# EAGLE design MBO (EAGLE 7.4.0)
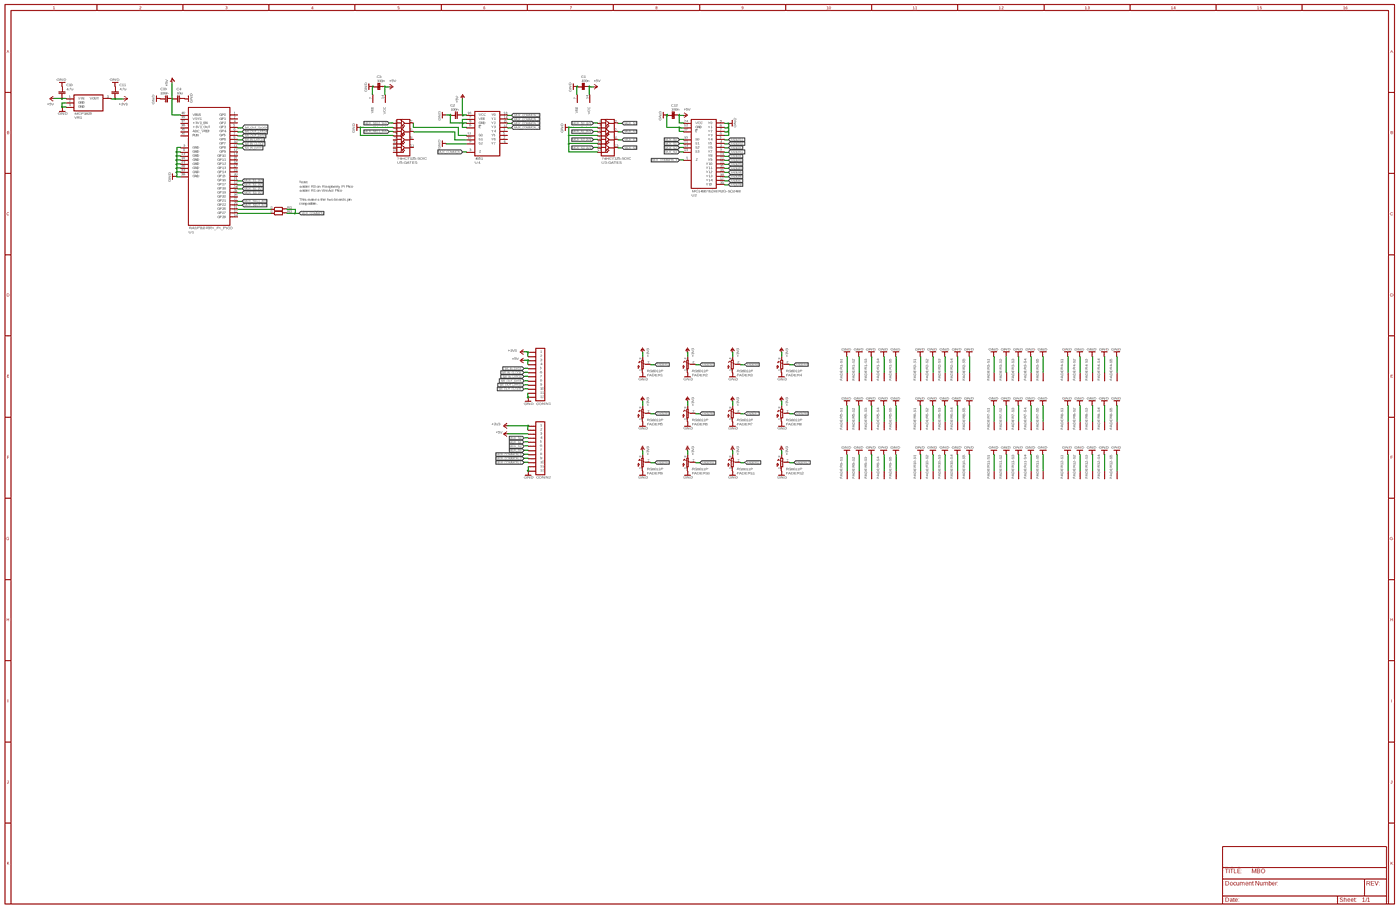
[diagram p0: schematic, sheet 1, overview]
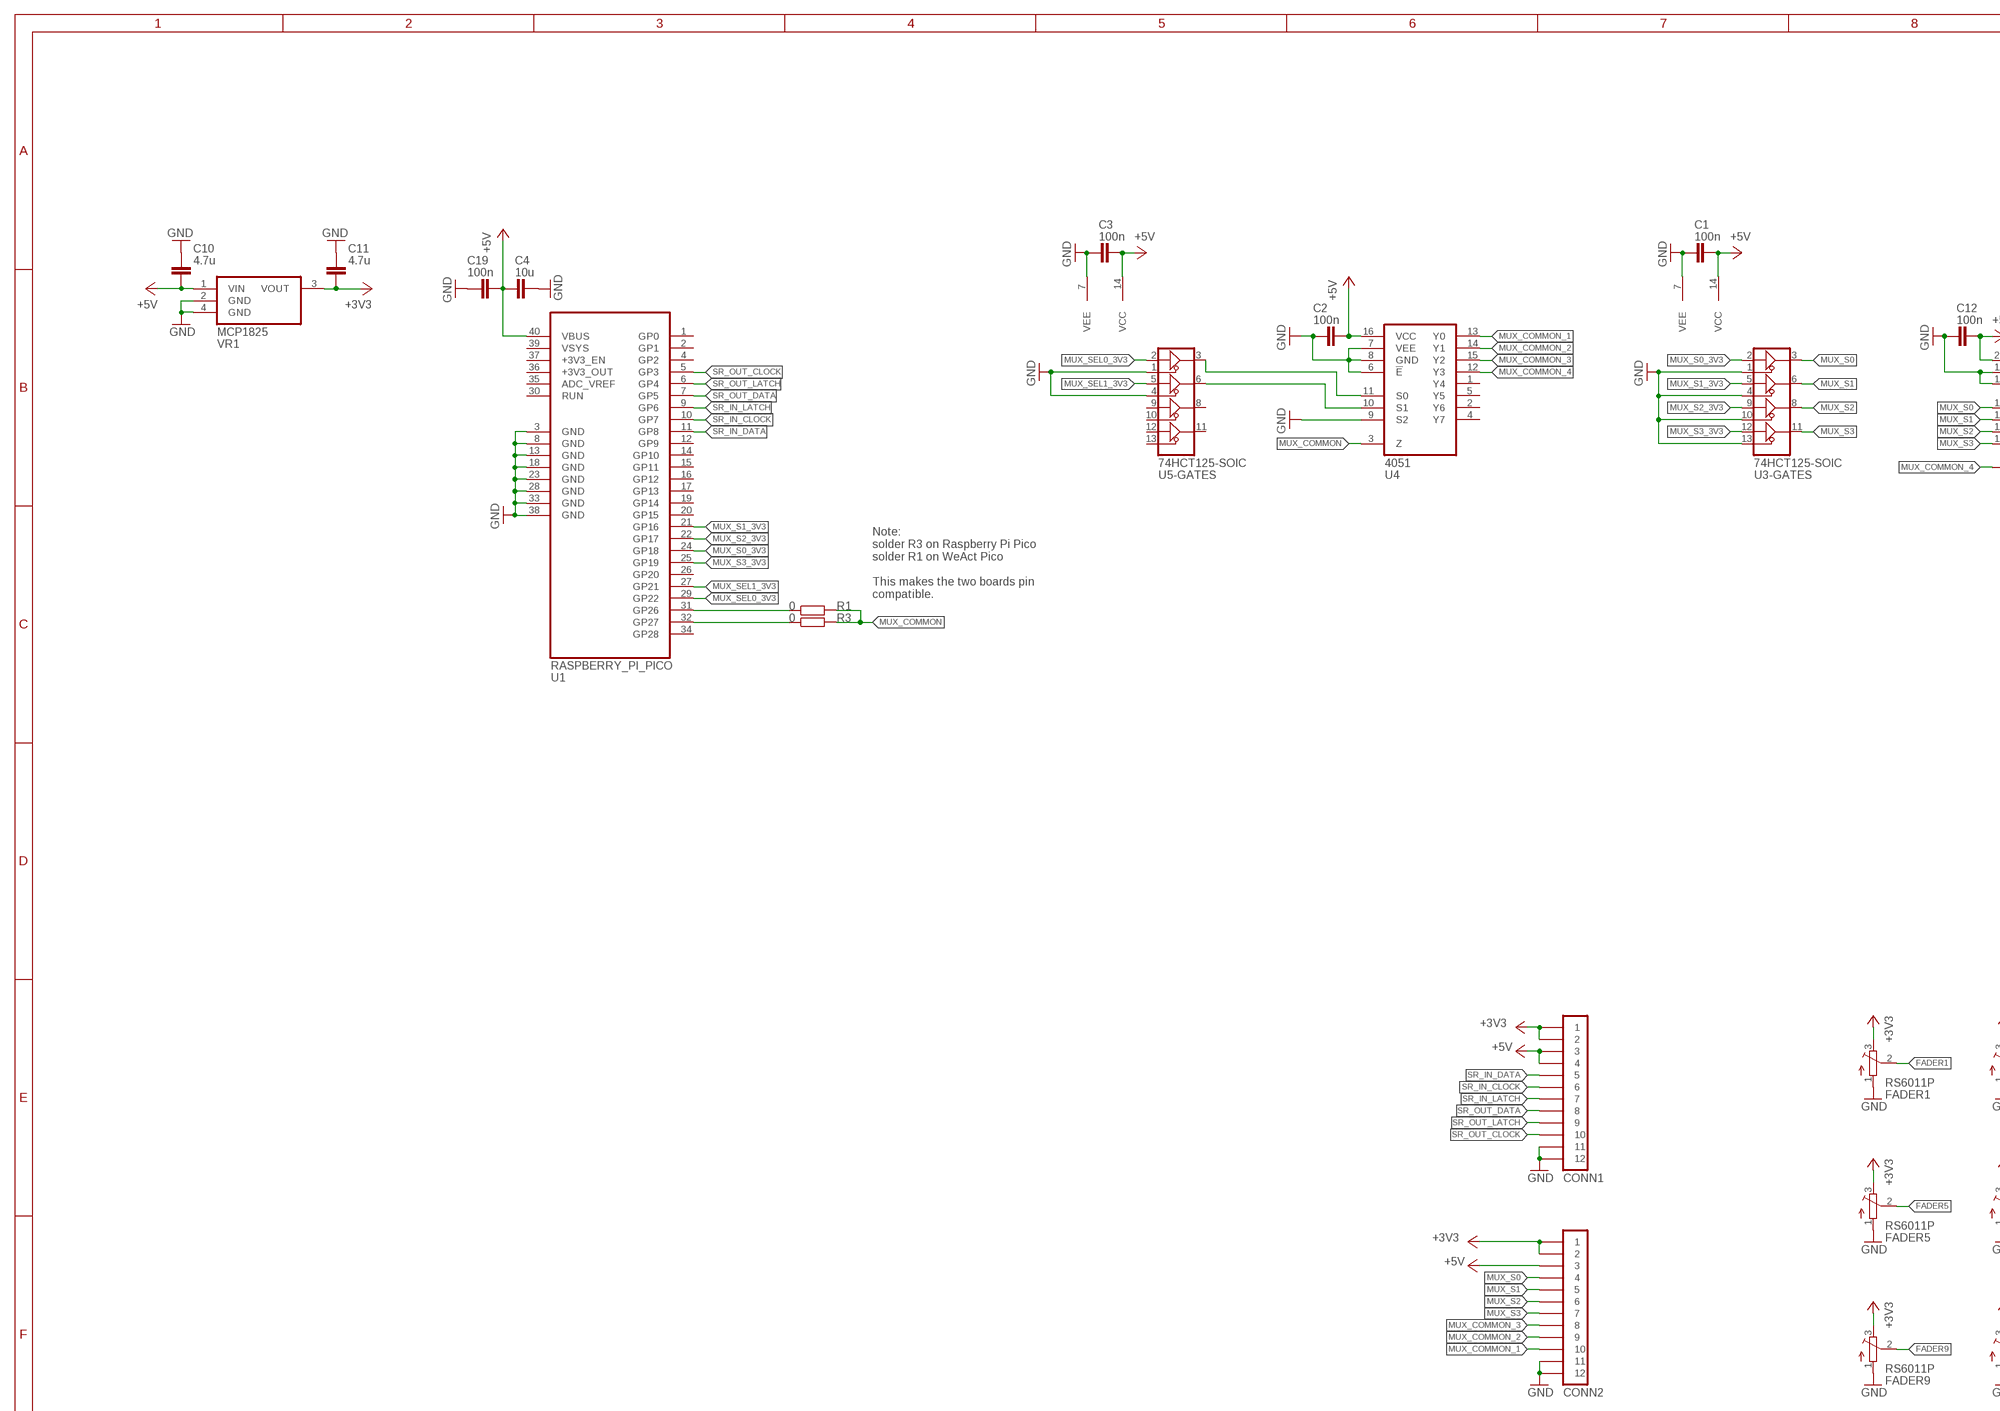
[diagram p1: schematic, sheet 1, part 1 of 4]
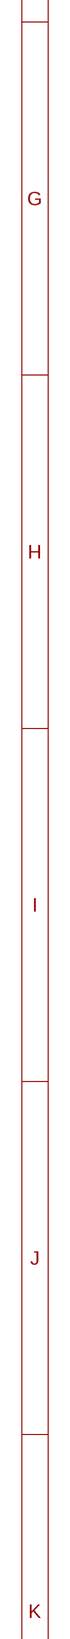
[diagram p2: schematic, sheet 1, part 2 of 4]
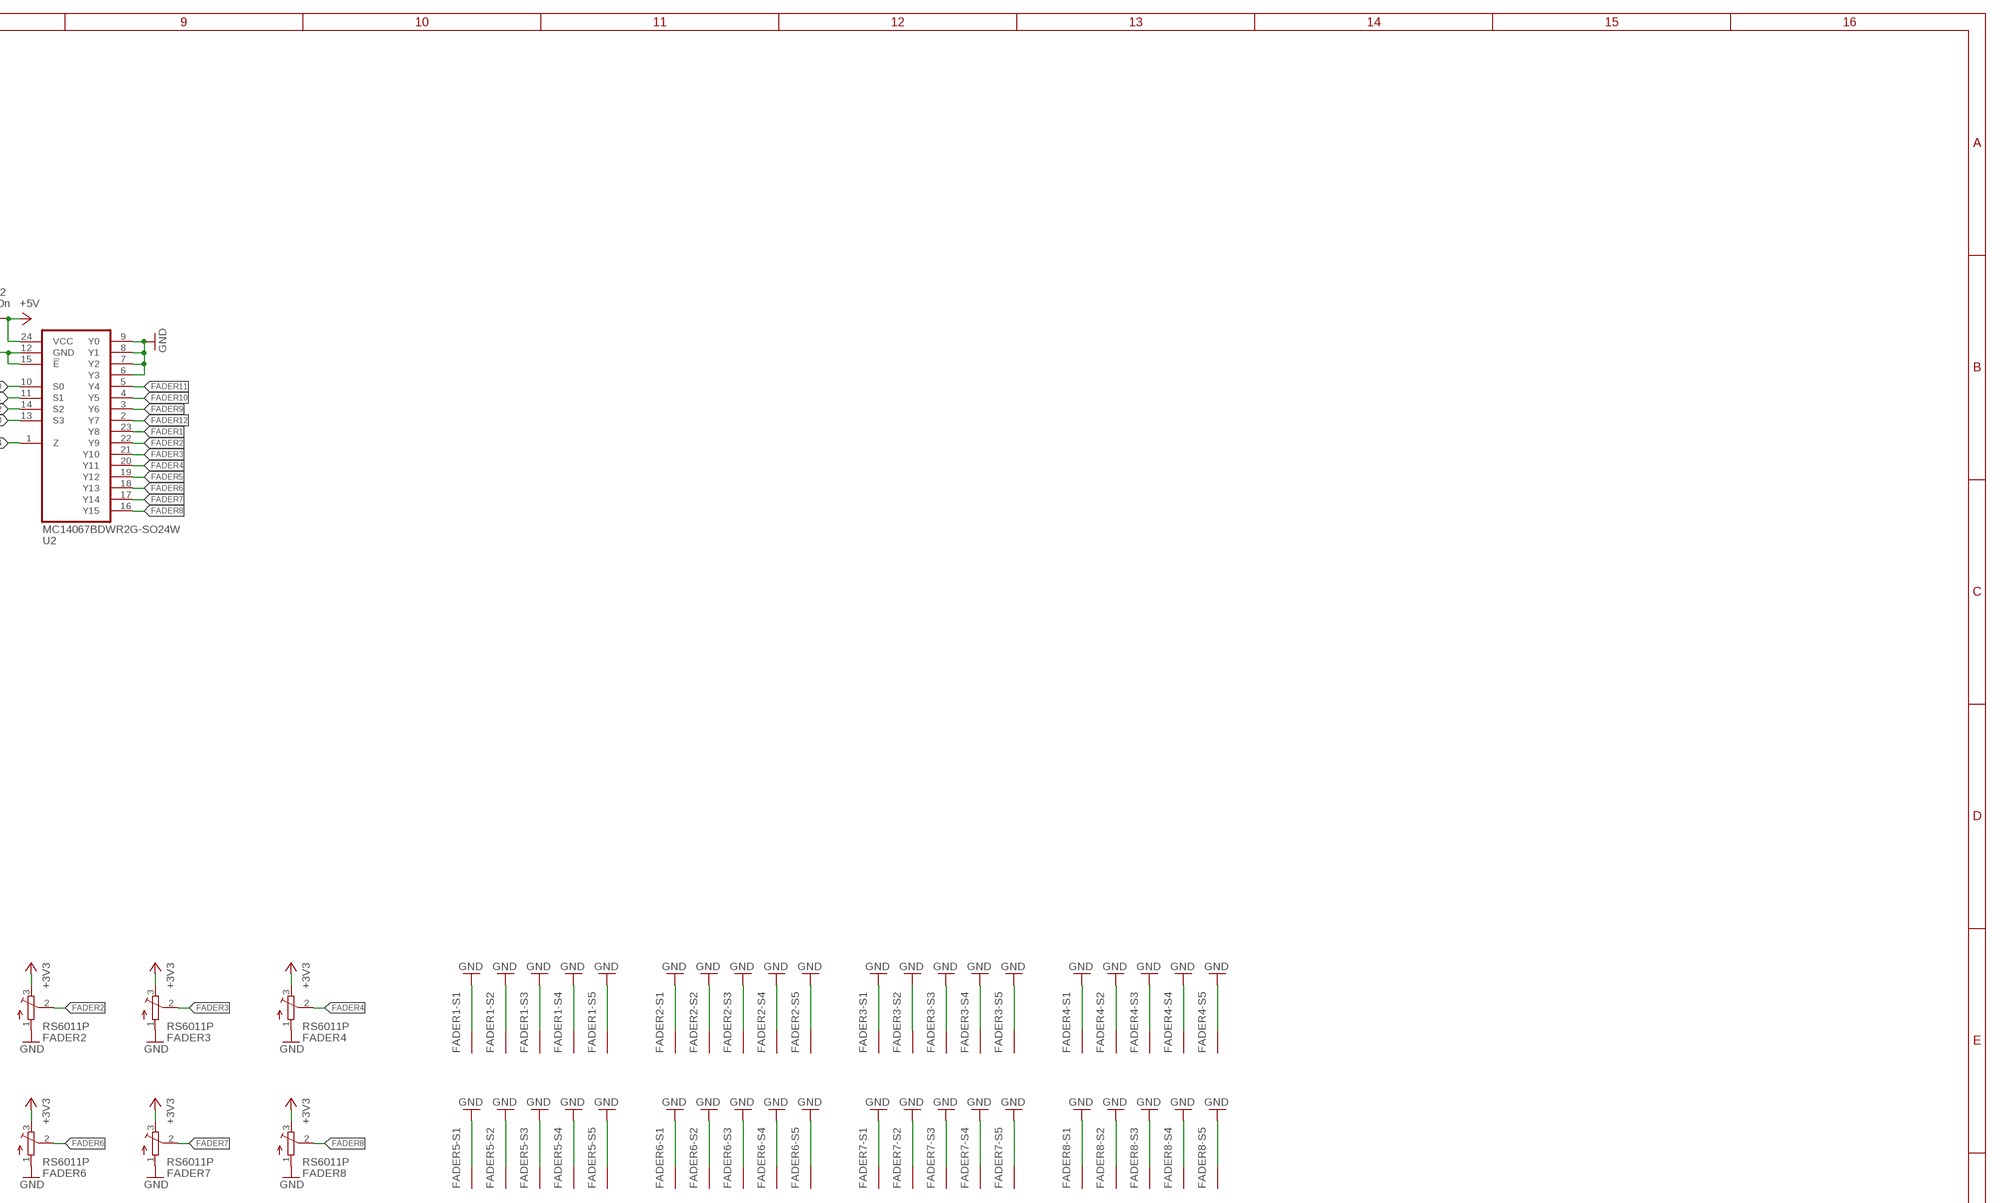
[diagram p3: schematic, sheet 1, part 3 of 4]
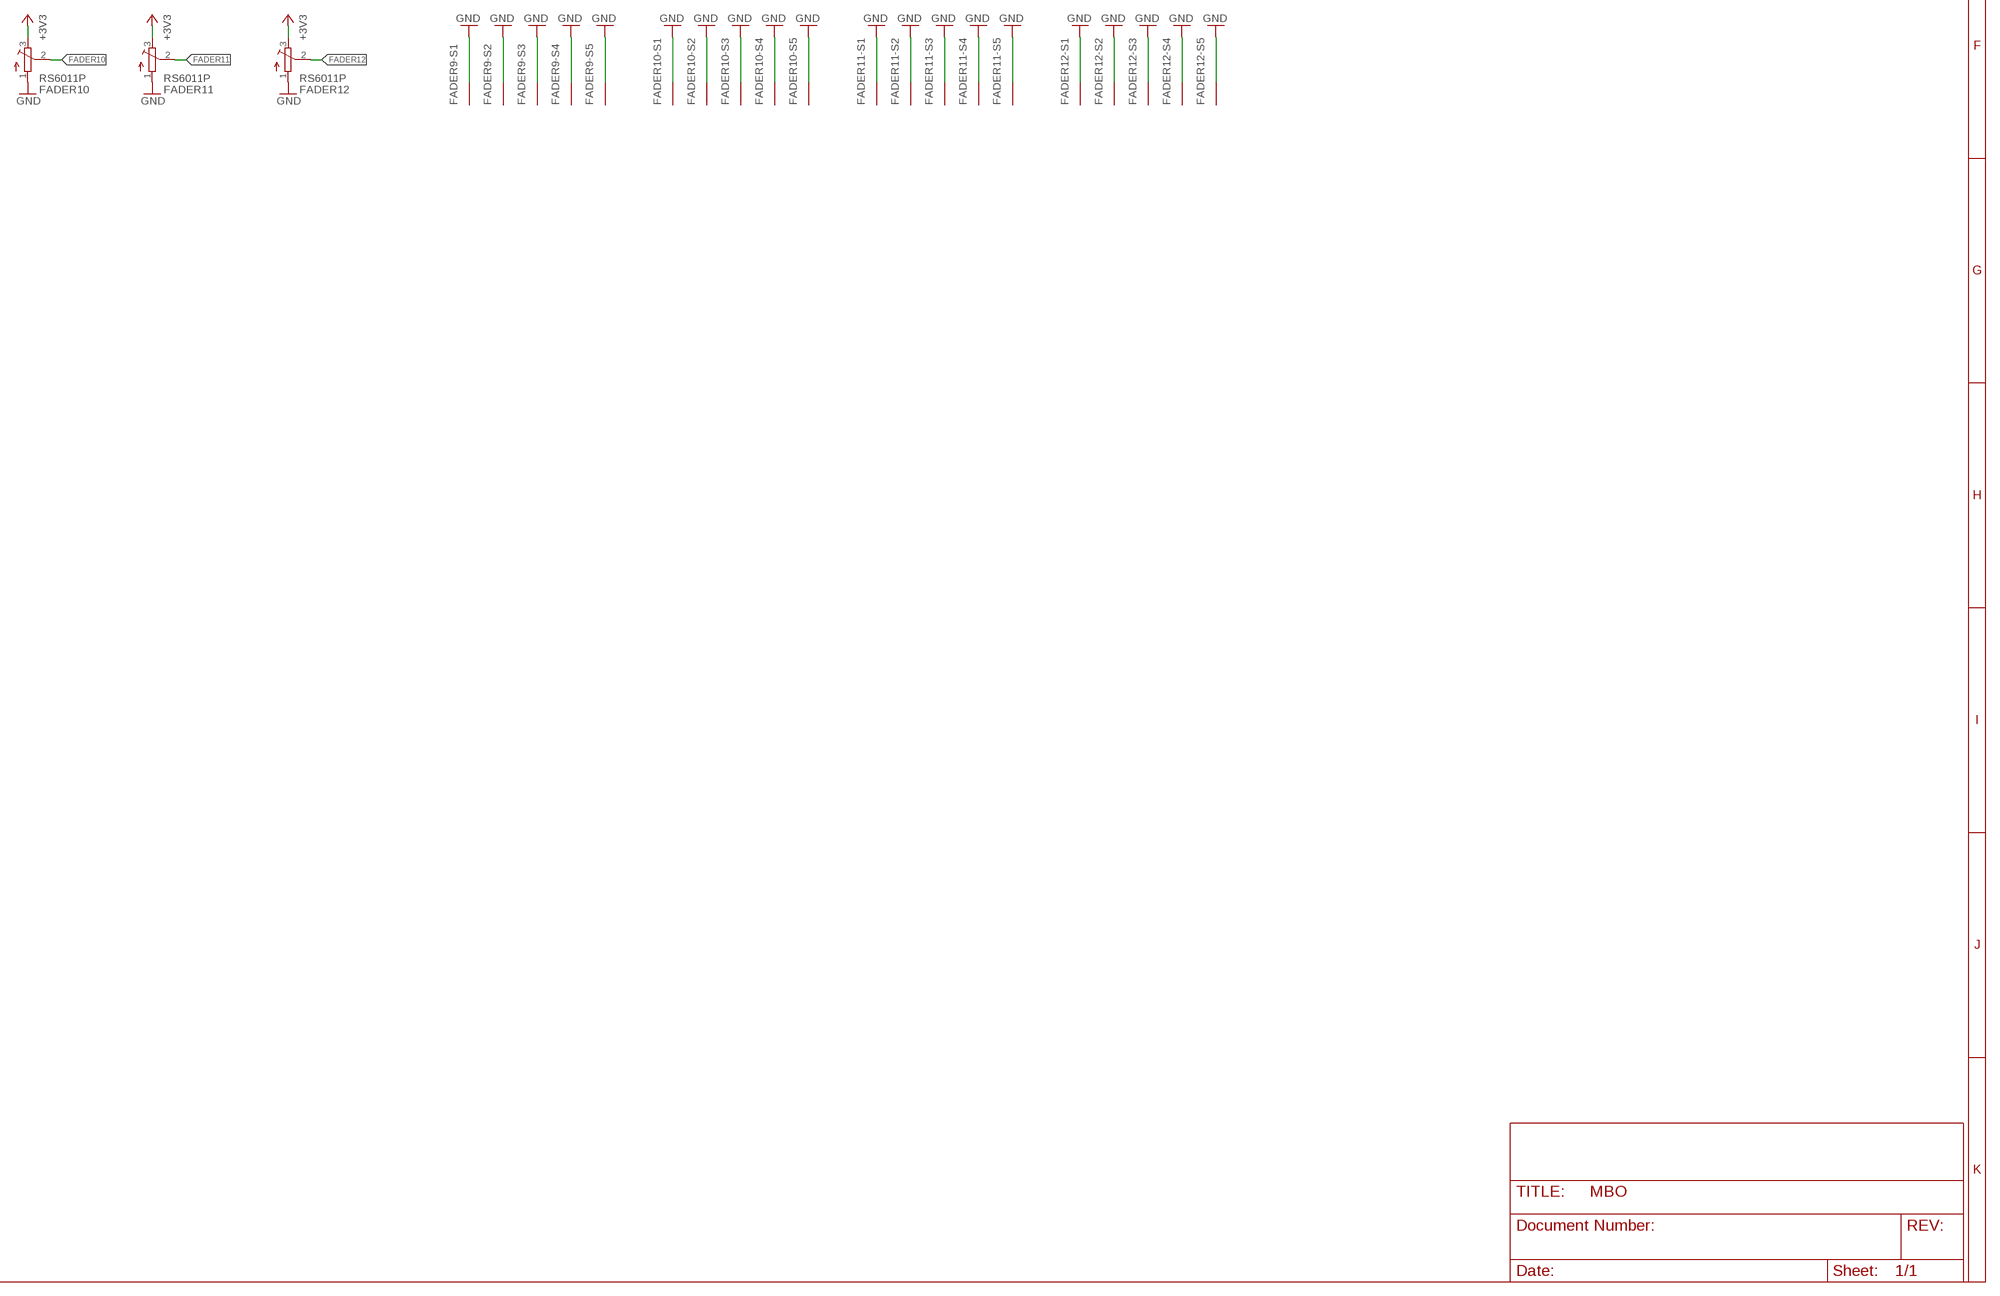
[diagram p4: schematic, sheet 1, part 4 of 4]

## Parts
C1  100n  CAPACITOR-0805  [C0805]
C2  100n  CAPACITOR-0805  [C0805]
C3  100n  CAPACITOR-0805  [C0805]
C4  10u  CAPACITOR-0805  [C0805]
C10  4.7u  CAPACITOR-0805  [C0805]
C11  4.7u  CAPACITOR-0805  [C0805]
C12  100n  CAPACITOR-0805  [C0805]
C19  100n  CAPACITOR-0805  [C0805]
CONN1  PINHD-1X12-SMD  [MOLEX-52271-1279]
CONN2  PINHD-1X12-SMD  [MOLEX-52271-1279]
FADER1  RS6011P  [RS6011*P]
FADER2  RS6011P  [RS6011*P]
FADER3  RS6011P  [RS6011*P]
FADER4  RS6011P  [RS6011*P]
FADER5  RS6011P  [RS6011*P]
FADER6  RS6011P  [RS6011*P]
FADER7  RS6011P  [RS6011*P]
FADER8  RS6011P  [RS6011*P]
FADER9  RS6011P  [RS6011*P]
FADER10  RS6011P  [RS6011*P]
FADER11  RS6011P  [RS6011*P]
FADER12  RS6011P  [RS6011*P]
R1  0  RESISTOR-0805  [R0805]
R3  0  RESISTOR-0805  [R0805]
U1  RASPBERRY_PI_PICO  [RASPBERRY_PI_PICO]
U2  MC14067BDWR2G-SO24W  [SO24-W]
U3  74HCT125-SOIC  [SOIC14]
U4  4051  [SO16]
U5  74HCT125-SOIC  [SOIC14]
VR1  MCP1825  [SOT223]

## Nets
+3V3: C11.1 CONN1.1 CONN1.2 CONN2.1 CONN2.2 FADER1.3 FADER2.3 FADER3.3 FADER4.3 FADER5.3 FADER6.3 FADER7.3 FADER8.3 FADER9.3 FADER10.3 FADER11.3 FADER12.3 VR1.3(VOUT)
+5V: C1.1 C2.1 C3.1 C4.2 C10.1 C12.1 C19.1 CONN1.3 CONN1.4 CONN2.3 U1.40(VBUS) U2.24(VCC) U3.14(-VCC:VCC) U4.16(VCC) U5.14(-VCC:VCC) VR1.1(VIN)
FADER1: FADER1.2 U2.23(Y8)
FADER2: FADER2.2 U2.22(Y9)
FADER3: FADER3.2 U2.21(Y10)
FADER4: FADER4.2 U2.20(Y11)
FADER5: FADER5.2 U2.19(Y12)
FADER6: FADER6.2 U2.18(Y13)
FADER7: FADER7.2 U2.17(Y14)
FADER8: FADER8.2 U2.16(Y15)
FADER9: FADER9.2 U2.3(Y6)
FADER10: FADER10.2 U2.4(Y5)
FADER11: FADER11.2 U2.5(Y4)
FADER12: FADER12.2 U2.2(Y7)
GND: C1.2 C2.2 C3.2 C4.1 C10.2 C11.2 C12.2 C19.2 CONN1.11 CONN1.12 CONN2.11 CONN2.12 FADER1.1 FADER1.S1(S) FADER1.S2(S) FADER1.S3(S) FADER1.S4(S) FADER1.S5(S) FADER2.1 FADER2.S1(S) FADER2.S2(S) FADER2.S3(S) FADER2.S4(S) FADER2.S5(S) FADER3.1 FADER3.S1(S) FADER3.S2(S) FADER3.S3(S) FADER3.S4(S) FADER3.S5(S) FADER4.1 FADER4.S1(S) FADER4.S2(S) FADER4.S3(S) FADER4.S4(S) FADER4.S5(S) FADER5.1 FADER5.S1(S) FADER5.S2(S) FADER5.S3(S) FADER5.S4(S) FADER5.S5(S) FADER6.1 FADER6.S1(S) FADER6.S2(S) FADER6.S3(S) FADER6.S4(S) FADER6.S5(S) FADER7.1 FADER7.S1(S) FADER7.S2(S) FADER7.S3(S) FADER7.S4(S) FADER7.S5(S) FADER8.1 FADER8.S1(S) FADER8.S2(S) FADER8.S3(S) FADER8.S4(S) FADER8.S5(S) FADER9.1 FADER9.S1(S) FADER9.S2(S) FADER9.S3(S) FADER9.S4(S) FADER9.S5(S) FADER10.1 FADER10.S1(S) FADER10.S2(S) FADER10.S3(S) FADER10.S4(S) FADER10.S5(S) FADER11.1 FADER11.S1(S) FADER11.S2(S) FADER11.S3(S) FADER11.S4(S) FADER11.S5(S) FADER12.1 FADER12.S1(S) FADER12.S2(S) FADER12.S3(S) FADER12.S4(S) FADER12.S5(S) U1.3(GND) U1.8(GND) U1.13(GND) U1.18(GND) U1.23(GND) U1.28(GND) U1.33(GND) U1.38(GND) U2.6(Y3) U2.7(Y2) U2.8(Y1) U2.9(Y0) U2.12(GND) U2.15(!E) U3.1(-GATES:1!(OE)) U3.4(-GATES:2!(OE)) U3.7(-GND:VEE) U3.10(-GATES:3!(OE)) U3.13(-GATES:4!(OE)) U4.6(!E) U4.7(VEE) U4.8(GND) U4.9(S2) U5.1(-GATES:1!(OE)) U5.4(-GATES:2!(OE)) U5.7(-GND:VEE) VR1.2(GND) VR1.4(GND)
MUX_COMMON: R1.2 R3.2 U4.3(Z)
MUX_COMMON_1: CONN2.10 U4.13(Y0)
MUX_COMMON_2: CONN2.9 U4.14(Y1)
MUX_COMMON_3: CONN2.8 U4.15(Y2)
MUX_COMMON_4: U2.1(Z) U4.12(Y3)
MUX_S0: CONN2.4 U2.10(S0) U3.3(-GATES:1Y)
MUX_S0_3V3: U1.24(GP18) U3.2(-GATES:1A)
MUX_S1: CONN2.5 U2.11(S1) U3.6(-GATES:2Y)
MUX_S1_3V3: U1.21(GP16) U3.5(-GATES:2A)
MUX_S2: CONN2.6 U2.14(S2) U3.8(-GATES:3Y)
MUX_S2_3V3: U1.22(GP17) U3.9(-GATES:3A)
MUX_S3: CONN2.7 U2.13(S3) U3.11(-GATES:4Y)
MUX_S3_3V3: U1.25(GP19) U3.12(-GATES:4A)
MUX_SEL0_3V3: U1.29(GP22) U5.2(-GATES:1A)
MUX_SEL1_3V3: U1.27(GP21) U5.5(-GATES:2A)
N$1: U4.10(S1) U5.6(-GATES:2Y)
N$2: U4.11(S0) U5.3(-GATES:1Y)
N$4: R3.1 U1.32(GP27)
N$5: R1.1 U1.31(GP26)
SR_IN_CLOCK: CONN1.6 U1.10(GP7)
SR_IN_DATA: CONN1.5 U1.11(GP8)
SR_IN_LATCH: CONN1.7 U1.9(GP6)
SR_OUT_CLOCK: CONN1.10 U1.5(GP3)
SR_OUT_DATA: CONN1.8 U1.7(GP5)
SR_OUT_LATCH: CONN1.9 U1.6(GP4)
Unconnected: U1.1(GP0) U1.2(GP1) U1.4(GP2) U1.12(GP9) U1.14(GP10) U1.15(GP11) U1.16(GP12) U1.17(GP13) U1.19(GP14) U1.20(GP15) U1.26(GP20) U1.30(RUN) U1.34(GP28) U1.35(ADC_VREF) U1.36(+3V3_OUT) U1.37(+3V3_EN) U1.39(VSYS) U4.1(Y4) U4.2(Y6) U4.4(Y7) U4.5(Y5) U5.8(-GATES:3Y) U5.9(-GATES:3A) U5.10(-GATES:3!(OE)) U5.11(-GATES:4Y) U5.12(-GATES:4A) U5.13(-GATES:4!(OE))

## Notes on the sheet
- Note:
  solder R3 on Raspberry Pi Pico
  solder R1 on WeAct Pico
  
  This makes the two boards pin
  compatible.

## Library data of the parts
C1-C4 C10-C12 C19 = igor_lbr:CAPACITOR: Capacitor
CONN1 CONN2 = igor_lbr:PINHD-1X12: Pin header; MANUFACTURER: Molex; MPN: 52271-1279
FADER1-FADER12 = igor_lbr:RS6011*P: Potentiometer
R1 R3 = igor_lbr:RESISTOR: Resistor
U1 = igor_lbr:RASPBERRY_PI_PICO
U2 = igor_lbr:MC14067BDWR2G: 16-Channel Analog Multiplexer/Demultiplexer; MANUFACTURER: ON Semiconductor; MPN: MC14067BDWR2G
U3 U5 = igor_lbr:74*125: Quad buffer/line driver; MANUFACTURER: Nexperia; MPN: 74HCT125D
U4 = igor_lbr:4051
VR1 = igor_lbr:MCP1825: 500 mA, Low Voltage, Low Quiescent Current LDO Regulator; MANUFACTURER: Microchip; MPN: MCP1825S-3302E/DB

## Board
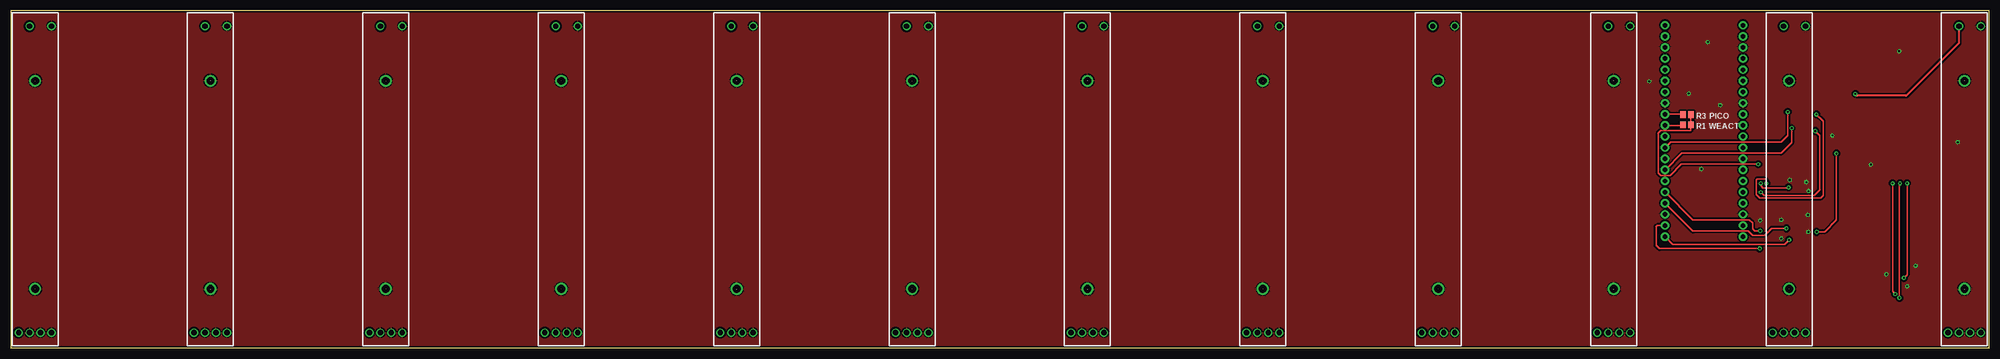
[diagram p5: board, top side]
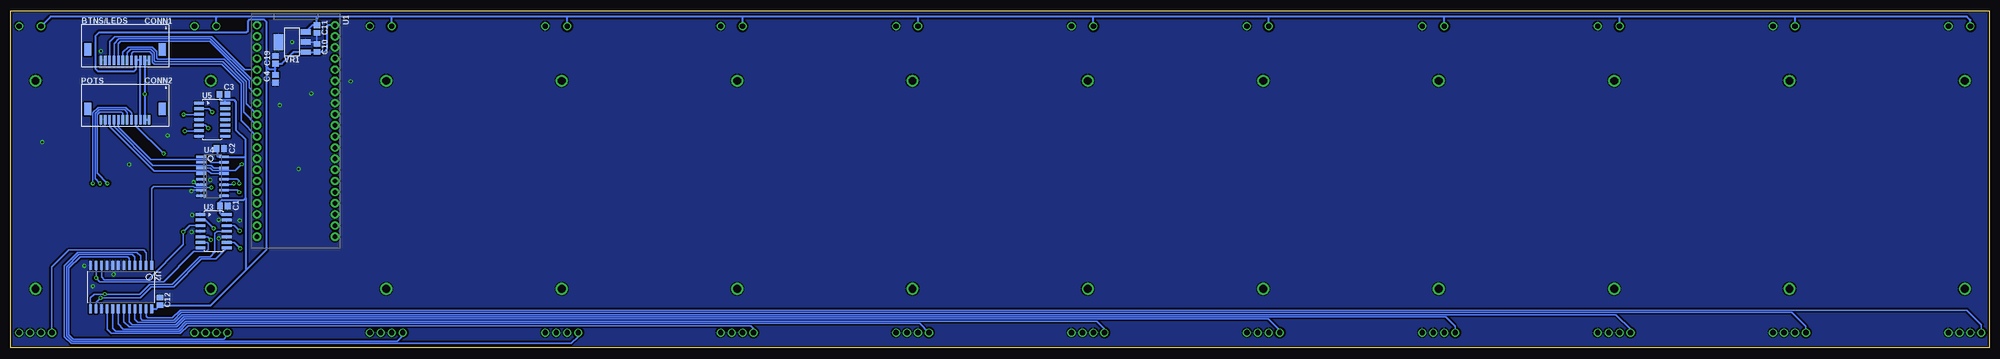
[diagram p6: board, bottom side, seen from below]

Size 451.1 x 76.96 mm. Coordinates in mm from the lower left corner, seen from the top.
Outline: 0,76.96 0,0 451.1,0 451.1,76.96 0,76.96
Copper layers (1*16): Top 0.035mm / dielectric 1.5mm / Bottom 0.035mm
Design rules "smiery *": minimum track width 8mil, minimum drill 12mil, track to track 6mil, track to pad 5mil, pad to pad 5mil, via to via 6mil, smd to smd 0mil, copper to edge 12mil, drill to drill 10mil, minimum pad ring 13mil, minimum via ring 10mil, stop-mask expansion 2mil, vias tented up to drill 25mil, thermal gap 10mil

### Footprints (pad centres in the part's own frame; a part is rotated, then mirrored left to right if it is on the bottom)
C0805 = smd 1.27 x 1.524: 1 -0.9,0; 2 0.9,0
MOLEX-52271-1279 = smd 0.6 x 2.2: 1 -5.5,3.5; 2 -4.5,3.5; 3 -3.5,3.5; 4 -2.5,3.5; 5 -1.5,3.5; 6 -0.5,3.5; 7 0.5,3.5; 8 1.5,3.5; 9 2.5,3.5; 10 3.5,3.5; 11 4.5,3.5; 12 5.5,3.5 | smd 1.65 x 2.8: S1 -8.5,1; S2 8.5,1
RS6011*P = drill 1.2: 1 -35,1.25; 2 -35,3.75; 3 35,1.25; S1 -35,-1.25; S2 -35,-3.75; S5 35,-3.75 | drill 1.8: S3 -25,0; S4 22.5,0
R0805 = smd 1.27 x 1.524: 1 -0.9,0; 2 0.9,0
RASPBERRY_PI_PICO = drill 1.016 pad 1.88: 1 1.27,50.8; 2 1.27,48.26; 3 1.27,45.72; 4 1.27,43.18; 5 1.27,40.64; 6 1.27,38.1; 7 1.27,35.56; 8 1.27,33.02; 9 1.27,30.48; 10 1.27,27.94; 11 1.27,25.4; 12 1.27,22.86; 13 1.27,20.32; 14 1.27,17.78; 15 1.27,15.24; 16 1.27,12.7; 17 1.27,10.16; 18 1.27,7.62; 19 1.27,5.08; 20 1.27,2.54; 21 19.05,2.54; 22 19.05,5.08; 23 19.05,7.62; 24 19.05,10.16; 25 19.05,12.7; 26 19.05,15.24; 27 19.05,17.78; 28 19.05,20.32; 29 19.05,22.86; 30 19.05,25.4; 31 19.05,27.94; 32 19.05,30.48; 33 19.05,33.02; 34 19.05,35.56; 35 19.05,38.1; 36 19.05,40.64; 37 19.05,43.18; 38 19.05,45.72; 39 19.05,48.26; 40 19.05,50.8
SO24-W = smd 2.032 x 0.6: 1 -4.975,6.985; 2 -4.975,5.715; 3 -4.975,4.445; 4 -4.975,3.175; 5 -4.975,1.905; 6 -4.975,0.635; 7 -4.975,-0.635; 8 -4.975,-1.905; 9 -4.975,-3.175; 10 -4.975,-4.445; 11 -4.975,-5.715; 12 -4.975,-6.985; 13 4.975,-6.985; 14 4.975,-5.715; 15 4.975,-4.445; 16 4.975,-3.175; 17 4.975,-1.905; 18 4.975,-0.635; 19 4.975,0.635; 20 4.975,1.905; 21 4.975,3.175; 22 4.975,4.445; 23 4.975,5.715; 24 4.975,6.985
SOIC14 = smd 2.2 x 0.66: 1 -3,3.81; 2 -3,2.54; 3 -3,1.27; 4 -3,0; 5 -3,-1.27; 6 -3,-2.54; 7 -3,-3.81; 8 3,-3.81; 9 3,-2.54; 10 3,-1.27; 11 3,0; 12 3,1.27; 13 3,2.54; 14 3,3.81
SO16 = smd 2.2 x 0.6: 1 -2.6,4.445; 2 -2.6,3.175; 3 -2.6,1.905; 4 -2.6,0.635; 5 -2.6,-0.635; 6 -2.6,-1.905; 7 -2.6,-3.175; 8 -2.6,-4.445; 9 2.6,-4.445; 10 2.6,-3.175; 11 2.6,-1.905; 12 2.6,-0.635; 13 2.6,0.635; 14 2.6,1.905; 15 2.6,3.175; 16 2.6,4.445
SOT223 = smd 2.235 x 1.219: 1 -3.099,2.311; 2 -3.099,0; 3 -3.099,-2.311 | smd 2.2 x 3.6: 4 3.099,0

### Placement (x,y rotation side)
C1  402.57,32.41 0 bottom
C2  403.38,45.52 0 bottom
C3  402.61,57.91 0 bottom
C4  390.81,61.5 90 bottom
C10  381.33,68.5 90 bottom
C11  381.33,72.8 270 bottom
C12  417.12,10.65 90 bottom
C19  390.81,65.82 90 bottom
CONN1  425.1,69.2 180 bottom
CONN2  425.1,55.6 180 bottom
FADER1  5.5,38.5 90 top
FADER2  45.5,38.5 90 top
FADER3  85.5,38.5 90 top
FADER4  125.5,38.5 90 top
FADER5  165.5,38.5 90 top
FADER6  205.5,38.5 90 top
FADER7  245.5,38.5 90 top
FADER8  285.5,38.5 90 top
FADER9  325.5,38.5 90 top
FADER10  365.5,38.5 90 top
FADER11  405.5,38.5 90 top
FADER12  445.5,38.5 90 top
R1  382.19,50.97 0 top
R3  382.19,53.28 0 top
U1  396.27,22.89 0 bottom
U2  426,13.91 270 bottom
U3  404.89,26.66 0 bottom
U4  405.1,39.2 0 bottom
U5  405.23,52.15 0 bottom
VR1  386.98,69.86 180 bottom

### Tracks (layer width: path | path; a pad name or v marks a point on that pad's centre or on a via)
+3V3  (via drill 0.4 pad 0.6)
  Top 0.406: FADER12.3 444.25,69.65 432.2,57.6 421,57.6 v420.6,58
  Bottom 0.406: 384.12,72.17 VR1.3 382.36,73.7 C11.1 381.33,75.56 381.2,75.69 | 44.2,75.69 5.08,75.69 4.25,74.86 FADER1.3 | 44.2,75.69 84.2,75.69 | 84.2,75.69 124.21,75.69 | 124.21,75.69 164.34,75.69 | 164.34,75.69 204.22,75.69 | 204.22,75.69 244.09,75.69 | 244.09,75.69 284.23,75.69 | 284.23,75.69 324.1,75.69 | 324.1,75.69 364.24,75.69 | 364.24,75.69 381.2,75.69 | 381.2,75.69 404.11,75.69 | 404.11,75.69 404.25,75.56 FADER11.3 | 364.24,75.69 364.22,75.68 364.25,75.65 FADER10.3 | 324.1,75.69 324.25,75.55 FADER9.3 | 284.22,75.69 284.23,75.69 | 244.09,75.69 244.25,75.54 FADER7.3 | 164.34,75.69 164.22,75.58 164.25,75.55 FADER5.3 | 44.2,75.69 44.25,75.64 FADER2.3 | FADER8.3 284.25,75.67 284.23,75.69 | FADER6.3 204.25,75.66 204.22,75.69 | FADER4.3 124.25,75.65 124.21,75.69 | FADER3.3 84.25,75.64 84.2,75.69 | CONN2.1 CONN2.2 v420.6,58 CONN1.2 CONN1.1 | 404.11,75.69 442.06,75.69 FADER12.3
+5V
  Bottom 0.406: C10.1 381.38,67.55 VR1.1 386.68,67.55 389.31,64.92 C19.1 390.81,63.7 | 403.86,57.56 C3.1 403.51,56.81 403.4,56.7 402.4,56.7 | U3.14 401.9,30.48 403.1,30.48 403.47,30.85 C1.1 403.47,33.33 403,33.8 398.1,33.8 397.6,34.3 | 397.6,17.69 405.64,9.65 417.02,9.65 C12.1 417.93,8.93 U2.24 | C4.2 390.81,63.7 | C10.1 | C2.1 403.9,45.15 403.9,43.65 U4.16 397.64,43.65 397.6,43.6 | CONN2.3 CONN1.3 CONN1.4 422.6,63.6 423.1,63.1 431.2,63.1 431.8,63.7 431.8,71.3 431,72.1 397.4,72.1 397,72.5 397,74.62 396.6,75.03 393.4,75.03 392.9,74.53 392.9,64.3 | U1.40 378.81,73.69 379.1,73.4 379.1,68.2 379.7,67.6 C10.1 | 392.9,64.3 392.3,63.7 390.81,63.7 | 397.6,34.3 397.6,43.6 | 397.6,43.6 397.6,47.6 399.8,49.8 399.8,56.2 400.3,56.7 402.4,56.7 | 397.6,34.3 397.6,17.69 | U5.14 402.23,56.53 402.4,56.7 | 392.9,64.3 392.9,22.39 397.6,17.69
FADER1
  Bottom 0.305: U2.23 420.28,7.28 419.86,6.86 414.27,6.86 412.5,8.64 5.08,8.64 1.75,5.31 FADER1.2
FADER2
  Bottom 0.305: U2.22 421.55,6.77 421.13,6.35 414.02,6.35 412.24,8.13 44.96,8.13 41.75,4.92 FADER2.2
FADER3
  Bottom 0.305: U2.21 422.82,6.51 422.15,5.84 413.77,5.84 411.99,7.62 85.09,7.62 81.75,4.28 FADER3.2
FADER4
  Bottom 0.305: U2.20 424.09,6.01 423.42,5.33 413.51,5.33 411.73,7.11 123.95,7.11 121.75,4.91 FADER4.2
FADER5
  Bottom 0.305: U2.19 425.36,6.01 424.18,4.83 413.26,4.83 411.48,6.6 164.34,6.6 161.75,4.02 FADER5.2
FADER6
  Bottom 0.305: U2.18 426.63,5.5 425.45,4.32 413,4.32 411.23,6.1 203.45,6.1 201.75,4.39 FADER6.2
FADER7
  Bottom 0.305: U2.17 427.9,4.48 427.23,3.81 412.75,3.81 410.97,5.59 243.84,5.59 FADER7.2
FADER8
  Bottom 0.305: U2.16 429.17,4.23 428.24,3.3 412.5,3.3 410.72,5.08 282.45,5.08 281.75,4.38 FADER8.2
FADER9
  Bottom 0.305: U2.3 421.55,20.99 422.4,21.84 435.86,21.84 438.91,18.8 438.91,2.54 437.39,1.02 323.34,1.02 321.75,2.61 FADER9.2
FADER10
  Bottom 0.305: U2.4 422.82,20.74 423.42,21.34 435.61,21.34 438.4,18.54 438.4,2.79 437.13,1.52 362.97,1.52 361.75,2.74 FADER10.2
FADER11
  Bottom 0.305: U2.5 424.09,20.48 424.43,20.83 435.36,20.83 437.9,18.29 437.9,3.05 436.88,2.03 402.59,2.03 401.75,2.87 FADER11.2
FADER12
  Bottom 0.305: U2.2 420.28,21.75 420.88,22.35 437.9,22.35 441.75,18.5 FADER12.2
GND  (via drill 0.4 pad 0.6)
  Bottom 0.305: C11.2 C10.2 381.79,69.86 VR1.2 | 389.68,70.25 VR1.4 390.37,69.86 | U4.7 409.75,36.02 v409.96,35.81 | U4.6 408.9,37.3 v409.45,37.85
  other vias: 405.64,38.35 434.34,18.8 432.42,14.1 427.71,16.82 424.18,41.91 415.4,48.54 443.99,46.99 403.71,29.27 430.59,67.76 387,69.88 385.51,40.86 373.63,60.88 382.63,58.13 389.79,55.41 398.91,29.07 409.81,30.37 409.91,26.47 403.71,24.97
  pour Top (isolate 0.406): 0,76.96 0,0 451.1,0 451.1,76.96
  pour Bottom (isolate 0.406): 0,76.96 0,0 451.1,0 451.1,76.96
MUX_COMMON  (via drill 0.4 pad 0.6)
  Top 0.305: R3.2 R1.2 383.1,49.7 383,49.6 376.2,49.6 375.7,49.1 375.7,39.9 376.2,39.4 378.4,39.4 380.95,41.95 v398.48,41.95
  Bottom 0.305: U4.3 405.7,41.1 405.1,40.5 399.93,40.5 v398.48,41.95
MUX_COMMON_1
  Bottom 0.305: U4.13 405.47,39.84 406.1,40.46 418.46,40.46 428.6,50.6 CONN2.10
MUX_COMMON_2
  Bottom 0.305: U4.14 404.81,41.1 405.4,41.7 418.8,41.7 427.6,50.5 CONN2.9
MUX_COMMON_3
  Bottom 0.305: U4.15 405.38,42.38 406,43 419.2,43 426.6,50.4 CONN2.8
MUX_COMMON_4  (via drill 0.4 pad 0.6)
  Top 0.305: v399.03,37.59 399.03,37.08 399.54,36.58 405.31,36.58 v405.38,36.65
  Bottom 0.305: U2.1 419.01,36.41 418.59,36.83 409.45,36.83 409.27,36.65 v405.38,36.65 | v399.03,37.59 399.03,38.1 399.5,38.56 U4.12
MUX_S0  (via drill 0.4 pad 0.6)
  Top 0.305: v416.3,44.4 416.3,29.2 413.6,26.5 v411.8,26.5
  Bottom 0.305: U3.3 410.37,27.93 v411.8,26.5 411.8,23.6 419.8,15.6 429.8,15.6 430.44,16.24 U2.10 | CONN2.4 422.6,50.7 v416.3,44.4
MUX_S0_3V3  (via drill 0.4 pad 0.6)
  Top 0.305: v404.9,27.3 401.5,27.3 399.9,25.7 397.2,25.7 396.2,26.7 383.58,26.7 U1.24
  Bottom 0.305: U3.2 406.8,29.2 v404.9,27.3
MUX_S1  (via drill 0.4 pad 0.6)
  Top 0.305: v432.4,37.6 432.4,16.7 v431.7,16
  Bottom 0.305: U2.11 431.71,16.91 431.7,16.9 v431.7,16 430.8,15.1 416.3,15.1 409.4,22 406.6,22 406.1,22.5 406.1,23.9 406.32,24.12 U3.6 | CONN2.5 423.6,53.6 424.9,54.9 431.2,54.9 432.4,53.7 v432.4,37.6
MUX_S1_3V3  (via drill 0.4 pad 0.6)
  Top 0.305: U1.21 378.96,23.7 404.5,23.7 v405.5,24.7
  Bottom 0.305: U3.5 406.19,25.39 v405.5,24.7
MUX_S2  (via drill 0.4 pad 0.6)
  Top 0.305: v430.68,11.43 430.68,37.48 v430.8,37.6
  Bottom 0.305: U2.14 431.71,10.4 v430.68,11.43 421.64,11.43 419.1,13.97 414.02,13.97 407.67,20.32 404.42,20.32 U3.8 | CONN2.6 424.6,53.8 425.2,54.4 431,54.4 431.9,53.5 431.9,38.7 v430.8,37.6
MUX_S2_3V3  (via drill 0.4 pad 0.6)
  Top 0.305: v398.8,22.7 375.9,22.7 375.2,23.4 375.2,27.7 375.47,27.97 U1.22
  Bottom 0.305: U3.9 400.22,24.12 v398.8,22.7
MUX_S3  (via drill 0.4 pad 0.6)
  Top 0.305: v429.1,37.6 429.1,12.9 v429.7,12.3
  Bottom 0.305: U3.11 404.04,26.66 404.6,26.1 404.6,21.9 405.7,20.8 408,20.8 414.3,14.5 419.5,14.5 421.7,12.3 v429.7,12.3 432.1,12.3 433,11.4 433,8.95 U2.13 | CONN2.7 425.6,53.6 425.9,53.9 430.8,53.9 431.4,53.3 431.4,39.9 v429.1,37.6
MUX_S3_3V3  (via drill 0.4 pad 0.6)
  Top 0.305: U1.25 383.57,29.25 396.45,29.25 397.2,28.5 397.2,27.2 397.7,26.7 v398.9,26.7
  Bottom 0.305: U3.12 400.13,27.93 v398.9,26.7
MUX_SEL0_3V3  (via drill 0.4 pad 0.6)
  Top 0.305: v405.2,53.9 405.2,48.5 403.7,47 378.47,47 U1.29
  Bottom 0.305: U5.2 405.99,54.69 v405.2,53.9
MUX_SEL1_3V3  (via drill 0.4 pad 0.6)
  Top 0.305: v406.1,50.2 406.1,46.9 403.7,44.5 381.05,44.5 U1.27
  Bottom 0.305: U5.5 406.78,50.88 v406.1,50.2
N$1  (via drill 0.4 pad 0.6)
  Top 0.305: v399.03,35.56 399.8,34.8 411.23,34.8 412.5,36.07 412.5,48.51 v411.48,49.53
  Bottom 0.305: v411.48,49.53 408.31,49.53 U5.6 | U4.10 399.5,36.02 v399.03,35.56
N$2  (via drill 0.4 pad 0.6)
  Top 0.305: v400.3,37.59 400.3,38.35 400.05,38.61 398.27,38.61 398.02,38.35 398.02,35.05 398.78,34.29 412.75,34.29 413.26,34.8 413.26,51.82 v411.73,53.34
  Bottom 0.305: v411.73,53.34 408.31,53.34 U5.3 | U4.11 400.6,37.3 v400.3,37.59
N$4
  Top 0.305: U1.32 381.2,53.37 R3.1
N$5
  Top 0.305: U1.31 381.16,50.83 R1.1
SR_IN_CLOCK
  Bottom 0.305: CONN1.6 424.6,67.4 423.8,68.2 419.2,68.2 418.4,67.4 418.4,65.6 418.2,65.4 402.8,65.4 398,60.6 398,53.83 U1.10
SR_IN_DATA
  Bottom 0.305: CONN1.5 423.6,67.3 423.2,67.7 419.5,67.7 418.9,67.1 418.9,65.3 418.4,64.8 403,64.8 398.6,60.4 398.6,51.89 U1.11
SR_IN_LATCH
  Bottom 0.305: CONN1.7 425.6,67.5 424.4,68.7 418.9,68.7 417.9,67.7 417.9,66.2 417.6,65.9 402.5,65.9 397.4,60.8 397.4,55.77 U1.9
SR_OUT_CLOCK
  Bottom 0.305: CONN1.10 428.6,69.9 427.4,71.1 405.3,71.1 397.73,63.53 U1.5
SR_OUT_DATA
  Bottom 0.305: CONN1.8 426.6,69.5 426.1,70 405.8,70 396.8,61 396.8,59.4 395.85,58.45 U1.7
SR_OUT_LATCH
  Bottom 0.305: CONN1.9 427.6,69.5 426.5,70.6 405.6,70.6 395.99,60.99 U1.6

### Text on the board
tNames: PICO | WEACT
bNames: BTNS/LEDS | POTS